# EAGLE design buseds-hab (EAGLE 6.4)
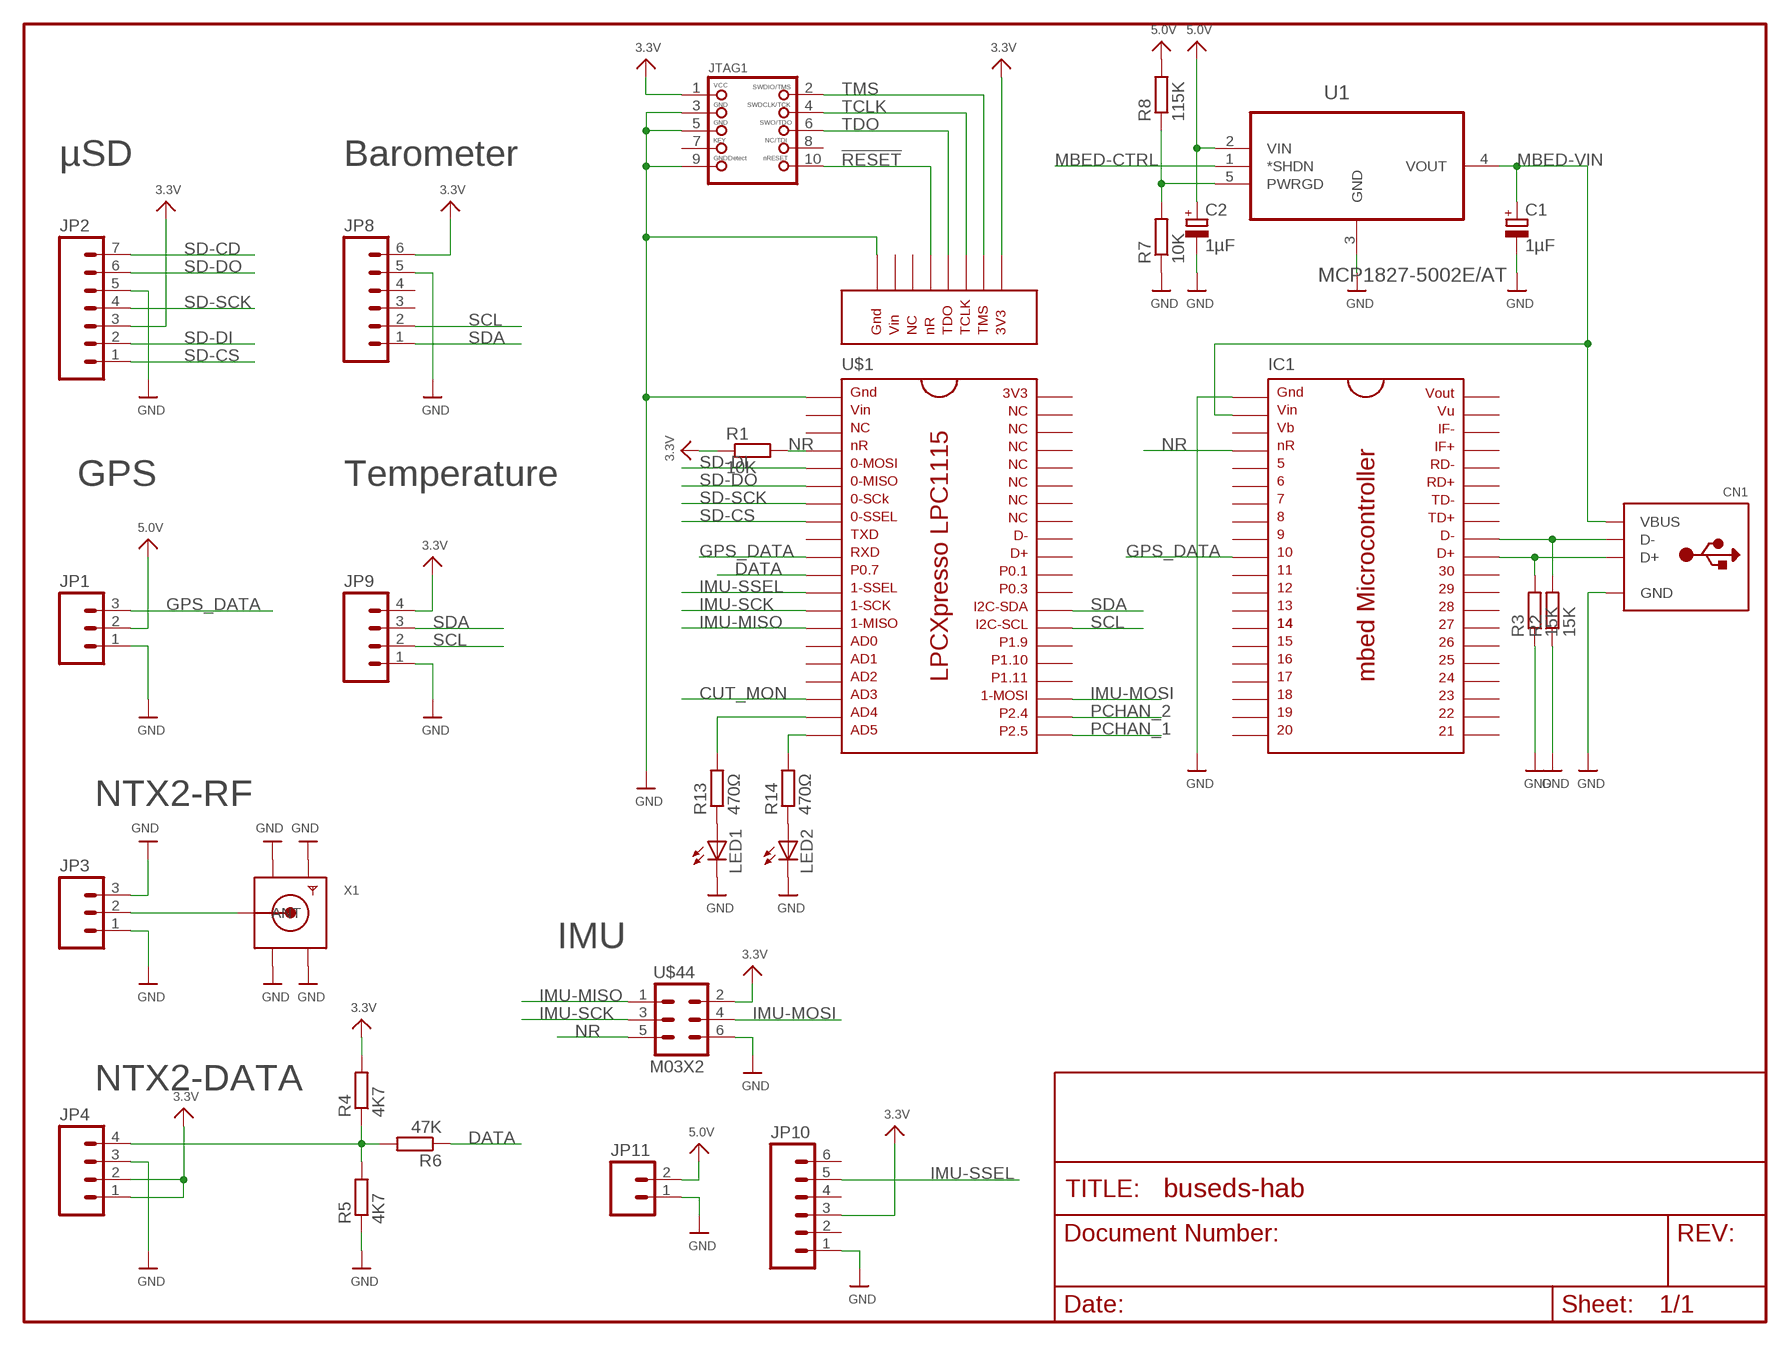
[diagram p0: schematic, sheet 1, part 1 of 2]
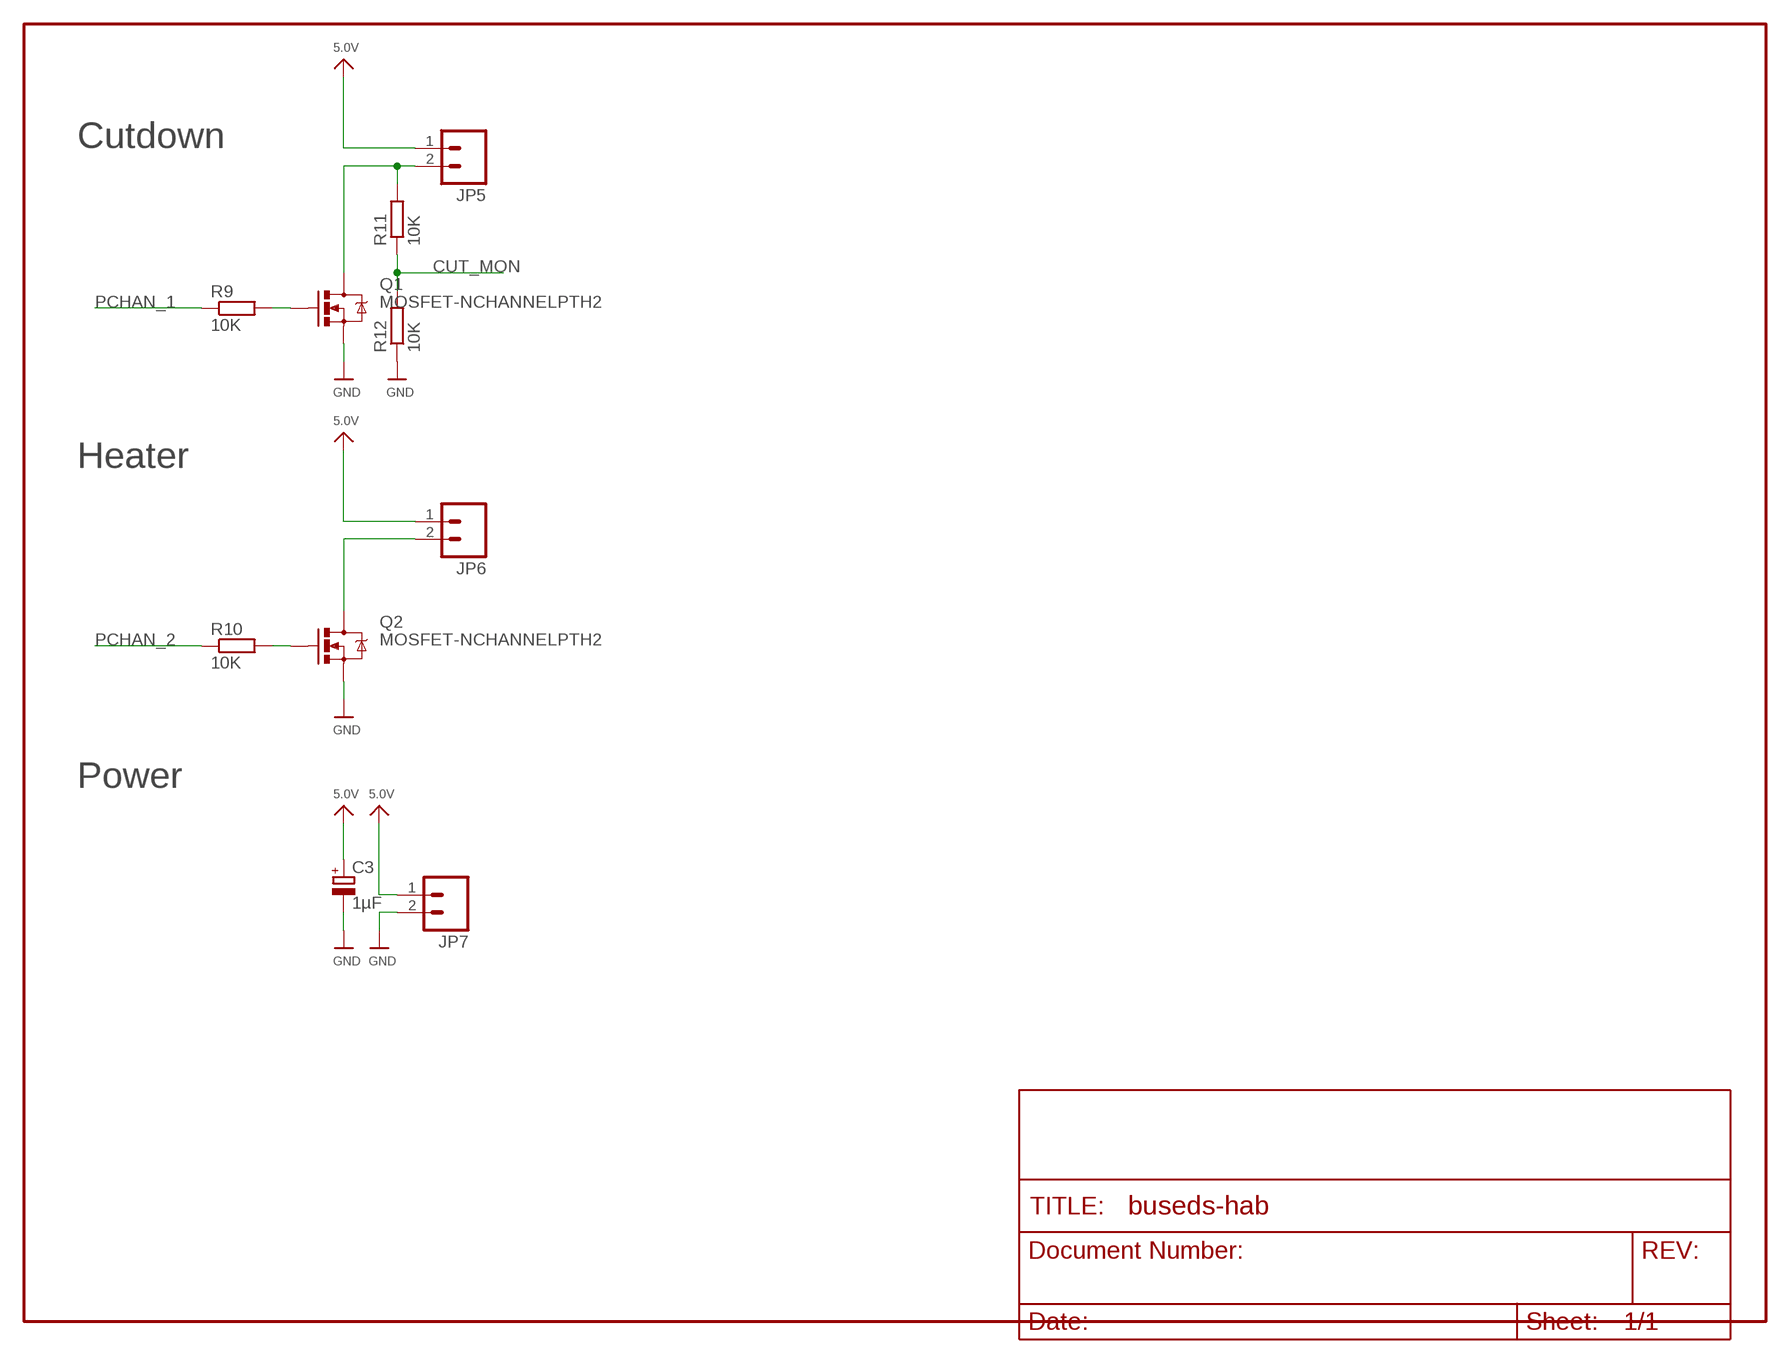
[diagram p1: schematic, sheet 1, part 2 of 2]

## Parts
C1  1µF  CPOL-EUE2-5  [E2-5]
C2  1µF  CPOL-EUE2-5  [E2-5]
C3  1µF  CPOL-EUE2-5  [E2-5]
CN1  USB_TYPEAPTHFML  [USB_HOST-PTH]
IC1  MBED  [DIL40_0.9]
JP1  M03LOCK  [1X03_LOCK]
JP2  M07LOCK  [1X07_LOCK]
JP3  M03LOCK  [1X03_LOCK]
JP4  M04LOCK  [1X04_LOCK]
JP5  M023.5MM_LOCK  [SCREWTERMINAL-3.5MM-2_LOCK]
JP6  M023.5MM_LOCK  [SCREWTERMINAL-3.5MM-2_LOCK]
JP7  M023.5MM_LOCK  [SCREWTERMINAL-3.5MM-2_LOCK]
JP8  M06LOCK  [1X06_LOCK]
JP9  M04LOCK  [1X04_LOCK]
JP10  M06LOCK  [1X06_LOCK]
JP11  M02LOCK  [1X02_LOCK]
JTAG1  JTAG-CORTEXM3  [2X05_1.27MM]
LED1  LED3MM  [LED3MM]
LED2  LED3MM  [LED3MM]
Q1  MOSFET-NCHANNELPTH2  [TO220V]
Q2  MOSFET-NCHANNELPTH2  [TO220V]
R1  10K  R-EU_0204/7  [0204/7]
R2  15K  R-EU_0204/7  [0204/7]
R3  15K  R-EU_0204/7  [0204/7]
R4  4K7  R-EU_0204/7  [0204/7]
R5  4K7  R-EU_0204/7  [0204/7]
R6  47K  R-EU_0204/7  [0204/7]
R7  10K  R-EU_0204/7  [0204/7]
R8  115K  R-EU_0204/7  [0204/7]
R9  10K  R-EU_0204/7  [0204/7]
R10  10K  R-EU_0204/7  [0204/7]
R11  10K  R-EU_0204/7  [0204/7]
R12  10K  R-EU_0204/7  [0204/7]
R13  470Ω  R-EU_0204/7  [0204/7]
R14  470Ω  R-EU_0204/7  [0204/7]
U1  MCP1827-5002E/AT  [TO170P482X1024X3124-5P]
U$1  LPCXPRESSOLPC  [LPCXPRESSO]
U$44  M03X2  [2X3_LOCK]
X1  SMACONNECTOR  [SMA90_DIP]

## Nets
3.3V: JP2.3 JP4.1 JP4.2 JP8.6 JP9.4 JP10.3 JTAG1.1 R1.1 R4.2 U$1.P-1 U$44.2
5.0V: C2.+ C3.+ JP1.2 JP5.1 JP6.1 JP7.1 JP11.2 R8.2 U1.2(VIN)
!RESET!: JTAG1.10 U$1.P-5
CUT_MON: R11.1 R12.2 U$1.18
D+: CN1.D+ IC1.31 R3.2
D-: CN1.D- IC1.32 R2.2
DATA: R6.1 U$1.11
GND: C1.- C2.- C3.- CN1.GND IC1.1 JP1.1 JP2.5 JP3.1 JP3.3 JP4.3 JP7.2 JP8.5 JP9.1 JP10.1 JP11.1 JTAG1.3 JTAG1.5 JTAG1.9 LED1.K(C) LED2.K(C) Q1.3(S) Q2.3(S) R2.1 R3.1 R5.1 R7.1 R12.1 U1.3(GND) U$1.1 U$1.P-8 U$44.6 X1.GND1 X1.GND2 X1.GND3 X1.GND4
GPS_DATA: IC1.10 JP1.3 U$1.10
IMU-MISO: U$1.14 U$44.1
IMU-MOSI: U$1.23 U$44.4
IMU-SCK: U$1.13 U$44.3
IMU-SSEL: JP10.5 U$1.12
MBED-CTRL: U1.1(*SHDN)
MBED-VIN: C1.+ CN1.VBUS IC1.2 U1.4(VOUT)
N$1: R7.2 R8.1 U1.5(PWRGD)
N$3: LED1.A R13.1
N$4: LED2.A R14.1
N$5: R14.2 U$1.20
N$6: R13.2 U$1.19
NR: IC1.4 R1.2 U$1.4 U$44.5
PCHAN_1: R9.1 U$1.21
PCHAN_1_G: Q1.1(G) R9.2
PCHAN_1_S: JP5.2 Q1.2(D) R11.2
PCHAN_2: R10.1 U$1.22
PCHAN_2_G: Q2.1(G) R10.2
PCHAN_2_S: JP6.2 Q2.2(D)
RF: JP3.2 X1.ANTENNA(ANT)
RF-DATA: JP4.4 R4.1 R5.2 R6.2
SCL: JP8.2 JP9.2 U$1.27
SD-CD: JP2.7
SD-CS: JP2.1 U$1.8
SD-DI: JP2.2 U$1.5
SD-DO: JP2.6 U$1.6
SD-SCK: JP2.4 U$1.7
SDA: JP8.1 JP9.3 U$1.28
TCLK: JTAG1.4 U$1.P-3
TDO: JTAG1.6 U$1.P-4
TMS: JTAG1.2 U$1.P-2
Unconnected: IC1.3 IC1.5 IC1.6 IC1.7 IC1.8 IC1.9 IC1.11 IC1.12 IC1.13 IC1.14 IC1.15 IC1.16 IC1.17 IC1.18 IC1.19 IC1.20 IC1.21 IC1.22 IC1.23 IC1.24 IC1.25 IC1.26 IC1.27 IC1.28 IC1.29 IC1.30 IC1.33 IC1.34 IC1.35 IC1.36 IC1.37 IC1.38 IC1.39 IC1.40 JP8.3 JP8.4 JP10.2 JP10.4 JP10.6 JTAG1.7 JTAG1.8 U$1.2 U$1.3 U$1.9 U$1.15 U$1.16 U$1.17 U$1.24 U$1.25 U$1.26 U$1.29 U$1.30 U$1.31 U$1.32 U$1.33 U$1.34 U$1.35 U$1.36 U$1.37 U$1.38 U$1.39 U$1.40 U$1.P-6 U$1.P-7

## Notes on the sheet
- Cutdown
- µSD | Barometer
- Heater
- GPS | Temperature
- Power
- NTX2-RF
- IMU
- NTX2-DATA

## Library data of the parts
C1-C3 = resistor:CPOL-EU: POLARIZED CAPACITOR, European symbol
CN1 = microbuilder_v3:USB_TYPEA: USB - Type A Connectors Male types stick out and are inserted into a PC or matching females parts (these are the connectors used on USB Memory Sticks, etc.). Female parts are generally used for USB Host and accept a male-type connector. SMT Male - 4UCON: 10017 PTH Female - Digikey: 609-1045-ND, 4UCon: 05241
IC1 = microbuilder_v3:MBED: mbed Microcontroller, DIP40, 0.9"
JP1 JP3 = SparkFun:M03: Header 3 Standard 3-pin 0.1" header. Use with straight break away headers (SKU : PRT-00116), right angle break away headers (PRT-00553), swiss pins (PRT-00743), machine pins (PRT-00117), and female headers (PRT-00115). Molex polarized connector foot print use with SKU : PRT-08232 with associated crimp pins and housings.
JP2 = SparkFun:M07: Header 7 Standard 7-pin 0.1" header. Use with straight break away headers (SKU : PRT-00116), right angle break away headers (PRT-00553), swiss pins (PRT-00743), machine pins (PRT-00117), and female headers (PRT-00115). NOTES ON THE VARIANTS LOCK and LOCK_LONGPADS... This footprint was designed to help hold the alignment of a through-hole component (i.e. 7-pin header) while soldering it into place. You may notice that each hole has been shifted either up or down by 0.005 of an inch from it's more standard position (which is usually a perfectly straight line). This slight alteration caused the pins (the squares in the middle) to touch the edges of the holes. Because they are alternating, it causes a "brace" to hold the header in place. 0.005 has proven to be the perfect amount of "off-center" position when using our standard breakaway headers. Although looks a little odd when you look at the bare footprint, once you have a header in there, the alteration is very hard to notice. Also, if you push a header all the way into place, it is covered up entirely on the bottom side. This idea of altering the position of holes to aid alignment will be further integrated into the Sparkfun Library for other footprints. It can help hold any component with 3 or more connection pins.
JP4 JP9 = SparkFun:M04: Header 4 Standard 4-pin 0.1" header. Use with straight break away headers (SKU : PRT-00116), right angle break away headers (PRT-00553), swiss pins (PRT-00743), machine pins (PRT-00117), and female headers (PRT-00115). Molex polarized connector foot print use with SKU : PRT-08231 with associated crimp pins and housings. 1MM SMD Version SKU: PRT-10208
JP5-JP7 JP11 = SparkFun:M02: Header 2 Standard 2-pin 0.1" header. Use with straight break away headers (SKU : PRT-00116), right angle break away headers (PRT-00553), swiss pins (PRT-00743), machine pins (PRT-00117), and female headers (PRT-00115). Molex polarized connector foot print use with SKU : PRT-08233 with associated crimp pins and housings.
JP8 JP10 = SparkFun:M06: Header 6 Standard 6-pin 0.1" header. Use with straight break away headers (SKU : PRT-00116), right angle break away headers (PRT-00553), swiss pins (PRT-00743), machine pins (PRT-00117), and female headers (PRT-00115). Molex polarized connector foot print use with SKU : PRT-08094 with associated crimp pins and housings. NOTES ON THE VARIANTS LOCK and LOCK_LONGPADS... This footprint was designed to help hold the alignment of a through-hole component (i.e. 6-pin header) while soldering it into place. You may notice that each hole has been shifted either up or down by 0.005 of an inch from it's more standard position (which is a perfectly straight line). This slight alteration caused the pins (the squares in the middle) to touch the edges of the holes. Because they are alternating, it causes a "brace" to hold the component in place. 0.005 has proven to be the perfect amount of "off-center" position when using our standard breakaway headers. Although looks a little odd when you look at the bare footprint, once you have a header in there, the alteration is very hard to notice. Also, if you push a header all the way into place, it is covered up entirely on the bottom side. This idea of altering the position of holes to aid alignment will be further integrated into the Sparkfun Library for other footprints. It can help hold any component with 3 or more connection pins.
JTAG1 = microbuilder_v3:JTAG-CORTEXM3: Serial Wire (SW-DP) Connector This standard 0.05" 10-pin connector is for use with the Cortex M0/M3's native SWD (serial wire debugger) interface (SW-DP). Some boards support a 20-pin combined JTAG+SWD connector (SWJ-DP), such as the LPC1700 family, but many smaller devices only work with SWD which typically use the smaller 10-pin SW-DP connecter (the LPC1300 family, for example, only supports SWD). 2x05 1.27mm/0.05" Connector: This is the standard SMT connector defined by ARM for all Cortex devices, and should be used in most situations and for forward-compatibility since any new devices coming to market will likely use this connector. MOLEX 10 Pin 0.1" Connector: This 0.1" 10 pin connector has the same pin layout as the standard 0.05" connector, but is easier to work with if you are using standard jumper wires or custom cables to connect your SWD hardware. MOLEX 20 Pin 0.1" Connector: This 0.1" 20 pin connector is the same model used for ARM7/ARM9 JTAG debuggers, but is connected to match the pins on the Segger J-Link for ARM (which supports both JTAG and SWD debugging). See the following document from ARM for more information on Cortex M3 Debug Connectors: http://infocenter.arm.com/help/topic/com.arm.doc.faqs/attached/13634/cortex_debug_connectors.pdf And the following page for an overview with images of the different connector types: http://www.keil.com/peripherals/coresight/connectors.asp
LED1 LED2 = SparkFun:LED: LEDs Standard schematic elements and footprints for 5mm, 3mm, 1206, and 0603 sized LEDs. 5mm - Spark Fun Electronics SKU : COM-00529 (and others)
Q1 Q2 = SparkFun:MOSFET-NCHANNEL
R1-R14 = resistor:R-EU_: RESISTOR, European symbol
U1 = MCP1827:MCP1827-5002E/AT: IC LDO REG 1.5A 5.0V TO220-5; MPN: MCP1827-5002E/AT; OC_FARNELL: 1840847; OC_NEWARK: 88K5598; PACKAGE: TO-220-5; SUPPLIER: Microchip
U$1 = microbuilder_v3:LPCXPRESSO
U$44 = SparkFun:M03X2
X1 = microbuilder_v3:SMACONNECTOR: SMA Connector 90° DIP SMA Connector, 50 Ohm (4UConnector: 07259)

## Board
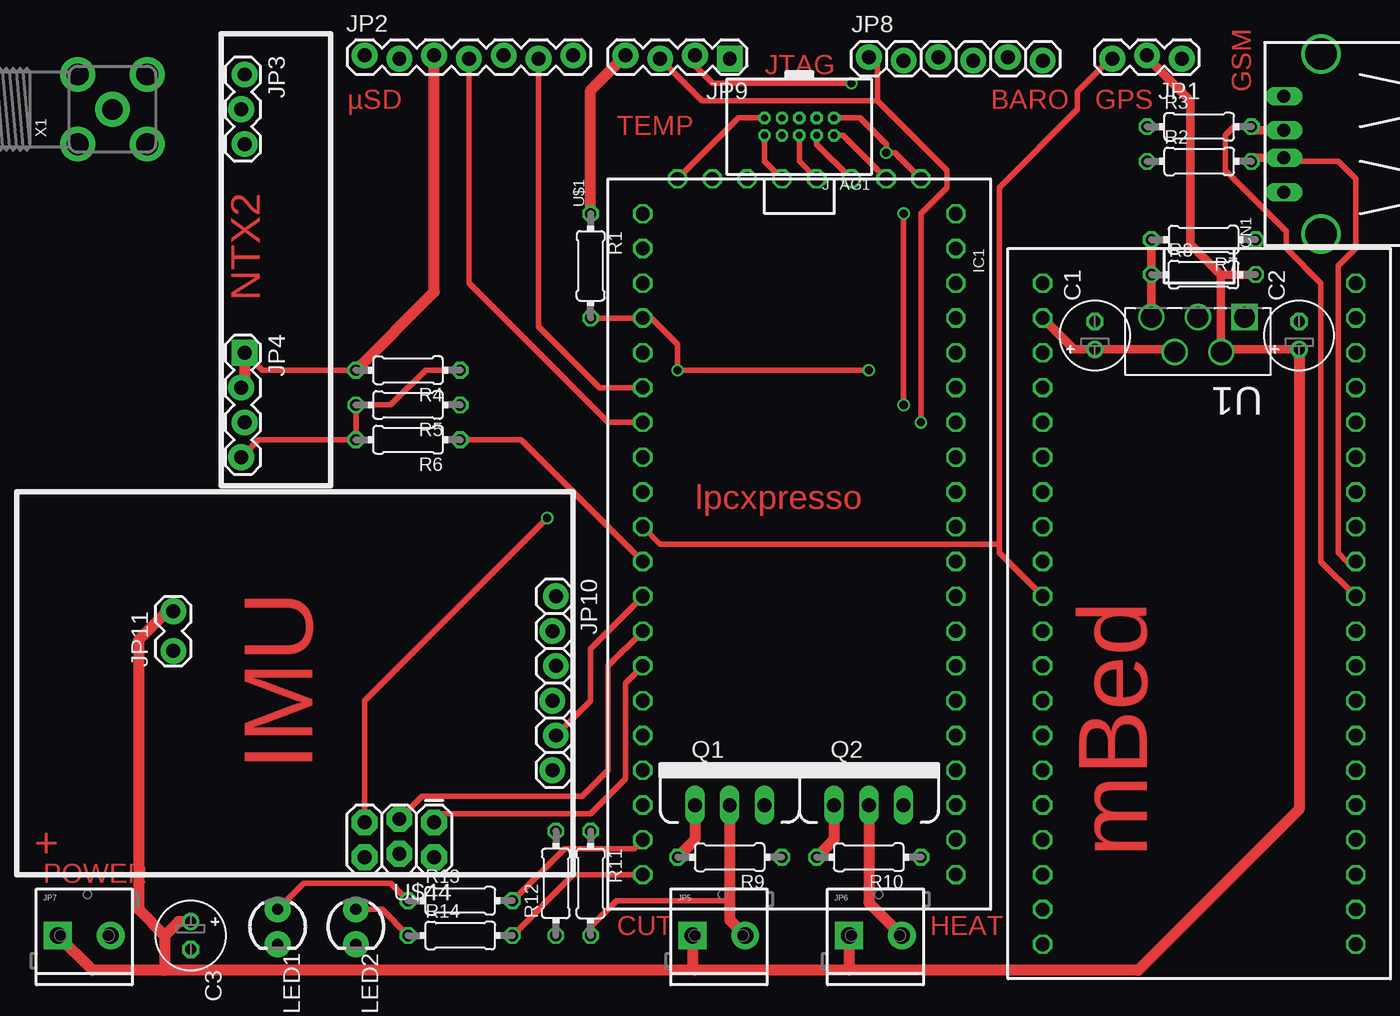
[diagram p2: board, top side]
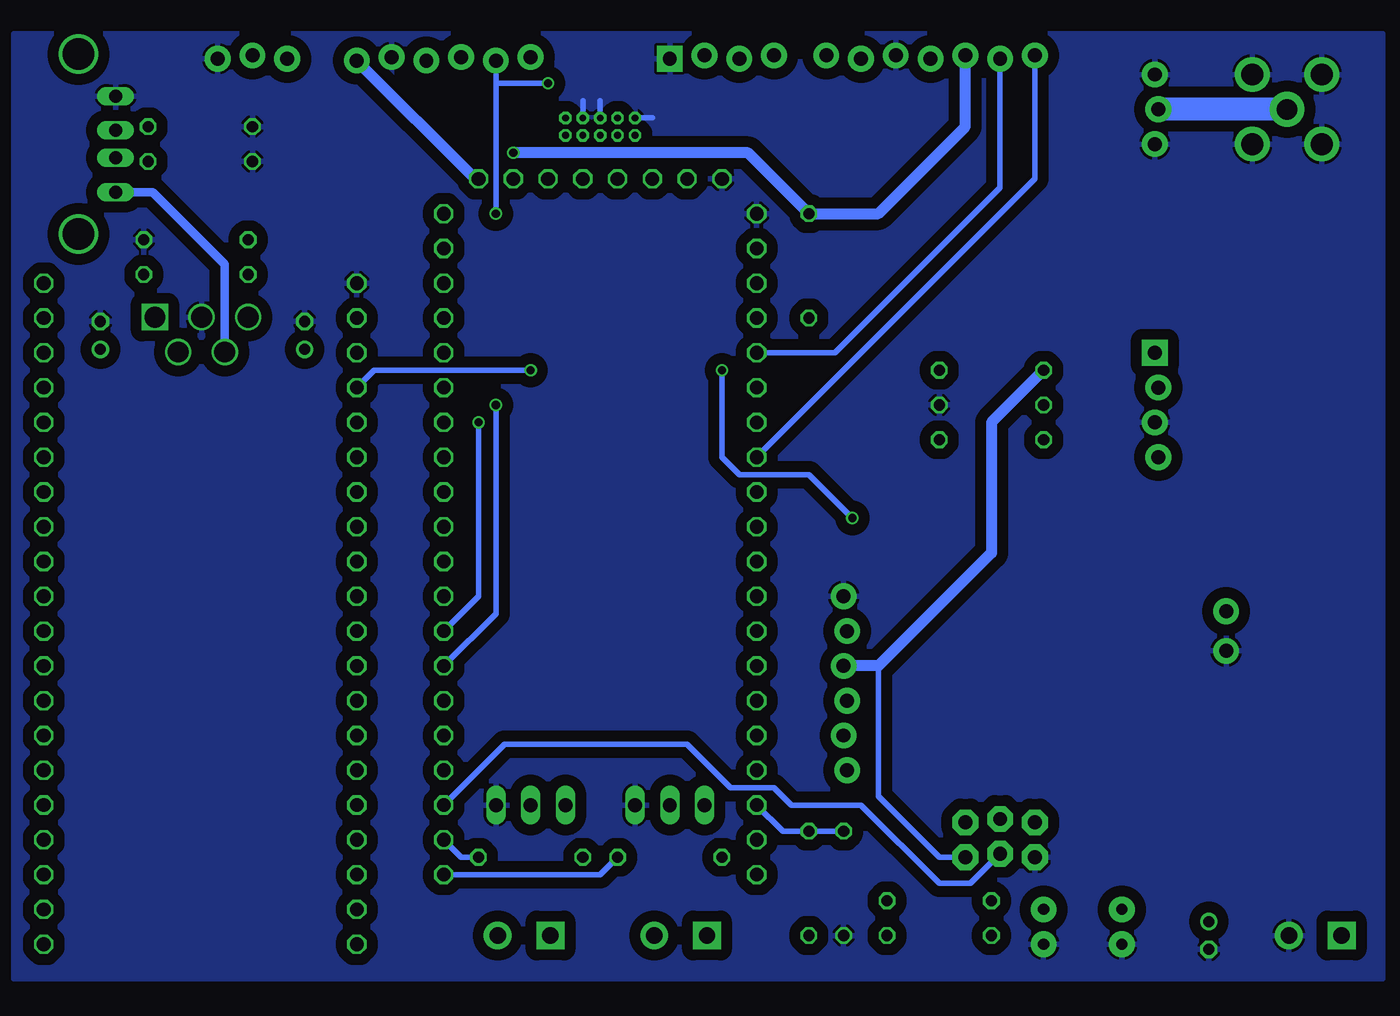
[diagram p3: board, bottom side, seen from below]

No outline drawn. Coordinates in mm, seen from the top.
Copper layers (1*16): Top 0.035mm / dielectric 1.5mm / Bottom 0.035mm
Design rules "PCB-POOL Standard": minimum track width 0.15mm, minimum drill 0.3mm, track to track 0.15mm, track to pad 0.15mm, pad to pad 0.15mm, via to via 0.15mm, smd to smd 0.15mm, copper to edge 0.3mm, drill to drill 0.2mm, minimum pad ring 0.2mm, minimum via ring 0.15mm, stop-mask expansion 0.075mm, vias tented up to drill 0mil, thermal gap 0.2mm

### Footprints (pad centres in the part's own frame; a part is rotated, then mirrored left to right if it is on the bottom)
E2-5 = drill 0.813 pad 1.27: + -1.016,0 | drill 0.813 pad 1.27 octagon: - 1.016,0
USB_HOST-PTH = drill 0.95 long: D+ 1,6.52; D- -1,6.52; GND 3.5,6.52; VBUS -3.5,6.52 | drill 2.3 pad 2.9: S1 -6.57,3.81; S2 6.57,3.81
DIL40_0.9 = drill 1 pad 1.397 octagon: 1 -22.86,-11.43; 2 -20.32,-11.43; 3 -17.78,-11.43; 4 -15.24,-11.43; 5 -12.7,-11.43; 6 -10.16,-11.43; 7 -7.62,-11.43; 8 -5.08,-11.43; 9 -2.54,-11.43; 10 0,-11.43; 11 2.54,-11.43; 12 5.08,-11.43; 13 7.62,-11.43; 14 10.16,-11.43; 15 12.7,-11.43; 16 15.24,-11.43; 17 17.78,-11.43; 18 20.32,-11.43; 19 22.86,-11.43; 20 25.4,-11.43; 21 25.4,11.43; 22 22.86,11.43; 23 20.32,11.43; 24 17.78,11.43; 25 15.24,11.43; 26 12.7,11.43; 27 10.16,11.43; 28 7.62,11.43; 29 5.08,11.43; 30 2.54,11.43; 31 0,11.43; 32 -2.54,11.43; 33 -5.08,11.43; 34 -7.62,11.43; 35 -10.16,11.43; 36 -12.7,11.43; 37 -15.24,11.43; 38 -17.78,11.43; 39 -20.32,11.43; 40 -22.86,11.43
1X03_LOCK = drill 1.016 pad 1.88: 1 0,0.127; 2 2.54,-0.127; 3 5.08,0.127
1X07_LOCK = drill 1.016 pad 1.88: 1 0,0.127; 2 2.54,-0.127; 3 5.08,0.127; 4 7.62,-0.127; 5 10.16,0.127; 6 12.7,-0.127; 7 15.24,0.127
1X04_LOCK = drill 1.016 pad 1.88 square: 1 0,0.127 | drill 1.016 pad 1.88: 2 2.54,-0.127; 3 5.08,0.127; 4 7.62,-0.127
SCREWTERMINAL-3.5MM-2_LOCK = drill 1.2 pad 2.032 square: 1 -0.178,0 | drill 1.2 pad 2.032: 2 3.678,0
1X06_LOCK = drill 1.016 pad 1.88: 1 0,0; 2 2.54,-0.254; 3 5.08,0; 4 7.62,-0.254; 5 10.16,0; 6 12.7,-0.254
1X02_LOCK = drill 1.016 pad 1.88: 1 -0.178,0; 2 2.718,0
2X05_1.27MM = drill 0.5 octagon: 1 -2.54,-0.635; 2 -2.54,0.635; 3 -1.27,-0.635; 4 -1.27,0.635; 5 0,-0.635; 6 0,0.635; 7 1.27,-0.635; 8 1.27,0.635; 9 2.54,-0.635; 10 2.54,0.635
LED3MM = drill 0.813 pad 1.88: A -1.27,0; K 1.27,0
TO220V = drill 1.016 long: 1 -2.54,0; 2 0,0; 3 2.54,0
0204/7 = drill 0.813 octagon: 1 -3.81,0; 2 3.81,0
TO170P482X1024X3124-5P = drill 1.524 square: 1 -6.807,-3.556 | drill 1.524: 2 -5.105,-1.016; 3 -3.404,-3.556; 4 -1.702,-1.016; 5 0,-3.556
LPCXPRESSO = drill 1 pad 1.397 octagon: 1 -21.59,-11.43; 2 -19.05,-11.43; 3 -16.51,-11.43; 4 -13.97,-11.43; 5 -11.43,-11.43; 6 -8.89,-11.43; 7 -6.35,-11.43; 8 -3.81,-11.43; 9 -1.27,-11.43; 10 1.27,-11.43; 11 3.81,-11.43; 12 6.35,-11.43; 13 8.89,-11.43; 14 11.43,-11.43; 15 13.97,-11.43; 16 16.51,-11.43; 17 19.05,-11.43; 18 21.59,-11.43; 19 24.13,-11.43; 20 26.67,-11.43; 21 26.67,11.43; 22 24.13,11.43; 23 21.59,11.43; 24 19.05,11.43; 25 16.51,11.43; 26 13.97,11.43; 27 11.43,11.43; 28 8.89,11.43; 29 6.35,11.43; 30 3.81,11.43; 31 1.27,11.43; 32 -1.27,11.43; 33 -3.81,11.43; 34 -6.35,11.43; 35 -8.89,11.43; 36 -11.43,11.43; 37 -13.97,11.43; 38 -16.51,11.43; 39 -19.05,11.43; 40 -21.59,11.43; P-1 -24.13,8.89; P-2 -24.13,6.35; P-3 -24.13,3.81; P-4 -24.13,1.27; P-5 -24.13,-1.27; P-6 -24.13,-3.81; P-7 -24.13,-6.35; P-8 -24.13,-8.89
2X3_LOCK = drill 1.016 pad 1.88 octagon: 1 0,0; 2 0,2.54; 3 2.54,-0.254; 4 2.54,2.286; 5 5.08,0; 6 5.08,2.54
SMA90_DIP = drill 1.5 pad 2.54: ANTENNA 0,0 | drill 1.6 pad 2.54: GND1 -2.54,2.54; GND2 2.54,2.54; GND3 -2.54,-2.54; GND4 2.54,-2.54

### Placement (x,y rotation side)
C1  78.74,46.99 90 top
C2  93.66,46.99 90 top
C3  12.7,3.17 270 top
CN1  99.06,60.96 90 top
IC1  86.36,27.94 270 top
JP1  85.09,67.31 180 top
JP2  25.4,67.31 0 top
JP3  16.51,66.04 270 top
JP4  16.51,45.72 270 top
JP5  49.53,3.17 0 top
JP6  60.96,3.17 0 top
JP7  3.17,3.17 0 top
JP8  62.23,67.31 0 top
JP9  52.07,67.31 180 top
JP10  39.37,27.94 270 top
JP11  11.43,24.13 90 top
JTAG1  57.15,62.23 180 top
LED1  19.05,3.81 270 top
LED2  24.77,3.81 270 top
Q1  52.07,12.7 0 top
Q2  62.23,12.7 0 top
R1  41.91,52.07 270 top
R2  86.36,59.69 0 top
R3  86.36,62.23 0 top
R4  28.57,44.45 180 top
R5  28.57,41.91 180 top
R6  28.57,39.37 180 top
R7  86.68,53.98 180 top
R8  86.68,51.44 0 top
R9  52.07,8.89 180 top
R10  62.23,8.89 180 top
R11  41.91,6.99 270 top
R12  39.37,6.99 90 top
R13  32.38,5.71 0 top
R14  32.38,3.17 0 top
U1  82.87,44.77 180 top
U$1  57.15,34.29 270 top
U$44  30.48,11.43 180 top
X1  6.99,63.5 90 top

### Tracks (layer width: path | path; a pad name or v marks a point on that pad's centre or on a via)
3.3V  (via drill 0.6)
  Top 0.406: JTAG1.1 61.59,62.87 63.5,60.96 v63.5,60.33 64.14,60.33 U$1.P-1 | JP4.1 17.91,44.45 R4.2 | 44.45,67.31 JP9.4
  Top 0.813: JP4.1 16.64,43.43 JP4.2 | R4.2 30.48,50.16 JP2.3 | R1.1 41.91,64.9 JP9.4
  Bottom 0.406: U$44.2 32.38,8.89 36.83,13.34 36.83,22.86
  Bottom 0.813: JP2.3 30.48,62.23 36.83,55.88 R1.1 46.35,60.33 v63.5,60.33 | JP8.6 66.29,58.42 U$1.P-1 | R4.2 28.57,40.64 28.57,31.11 36.83,22.86 JP10.3
5.0V
  Top 0.61: C2.+ 88.16,45.97 U1.2 87.95,45.81 87.95,51.44 | R8.2 87.95,51.44 | 87.95,51.44 85.72,53.66 85.72,64.14 82.55,67.31 JP1.2
  Top 0.813: JP6.1 60.78,0.64 | 60.78,0.64 49.53,0.64 | 49.53,0.64 10.79,0.64 | 10.79,0.64 5.54,0.64 JP7.1 | JP5.1 49.35,0.81 49.53,0.64 | C3.+ 11.81,4.19 10.79,3.17 | 10.79,3.17 10.79,0.64 | 60.78,0.64 81.92,0.64 93.66,12.38 C2.+ | 10.79,3.17 8.89,5.08 8.89,24.77 10.97,26.85 JP11.2
!RESET!
  Top 0.406: JTAG1.10 54.61,59.69 U$1.P-5
CUT_MON
  Bottom 0.406: U$1.18 43.81,10.79 R11.1 R12.2
D+
  Top 0.406: IC1.31 95.25,30.48 95.25,50.8 92.71,53.34 92.71,54.61 88.27,59.05 88.27,61.59 88.9,62.23 R3.2
  Top 0.61: R3.2 90.44,61.96 CN1.D+
D-
  Top 0.406: IC1.32 97.16,30.48 96.52,31.11 96.52,52.07 97.79,53.34 97.79,58.42 96.52,59.69 92.81,59.69 CN1.D-
  Top 0.61: CN1.D- 90.44,59.96 R2.2
DATA
  Top 0.406: R6.1 36.83,39.37 U$1.11
GND
  Top 0.406: JTAG1.9 52.7,62.87 U$1.P-8
  Bottom 0.406: JTAG1.9 53.34,62.87 | JTAG1.3 58.42,64.14 | JTAG1.5 57.15,64.14
  pour Bottom (isolate 0.8): 0,0 100,0 100,69 0,69
GPS_DATA
  Top 0.406: JP1.3 79.88,67.18 77.47,64.77 77.47,63.5 71.75,57.78 71.75,31.75 | 71.75,31.75 71.75,31.11 IC1.10 | U$1.10 46.99,31.75 71.75,31.75
IMU-MISO
  Top 0.406: U$44.1 31.11,12.06 41.91,12.06 44.45,14.61 44.45,21.59 U$1.14
IMU-MOSI
  Bottom 0.406: U$1.23 64.14,17.14 50.8,17.14 47.62,13.97 44.45,13.97 43.18,12.7 38.1,12.7 32.38,6.99 30.1,6.99 U$44.4
IMU-SCK
  Top 0.406: U$1.13 43.18,22.86 43.18,15.24 41.27,13.34 29.59,13.34 U$44.3
IMU-SSEL
  Top 0.406: U$1.12 41.91,24.13 41.91,20.32 JP10.5
MBED-VIN
  Top 0.61: IC1.2 77.22,45.97 C1.+ 84.38,45.97 U1.4
  Bottom 0.61: CN1.VBUS 89.84,57.46 84.57,52.18 U1.4
N$1
  Top 0.61: R7.2 82.87,52.07 R8.1 U1.5
N$3
  Top 0.406: R13.1 27.3,6.99 20.95,6.99 LED1.A
N$4
  Top 0.406: R14.1 26.67,5.08 LED2.A
N$5
  Top 0.406: U$1.20 40.64,7.62 R14.2
N$6
  Top 0.406: U$1.19 45.09,9.53 40.01,9.53 R13.2
NR  (via drill 0.6)
  Top 0.406: R1.2 U$1.4 46.35,48.26 48.26,46.35 v48.26,44.45 v62.23,44.45 | U$44.5 25.4,20.32 v38.73,33.66
  Bottom 0.406: IC1.4 73.66,44.45 v62.23,44.45 | v38.73,33.66 41.91,36.83 46.99,36.83 48.26,38.1 v48.26,44.45
PCHAN_1
  Bottom 0.406: U$1.21 57.15,7.62 R9.1
PCHAN_1_G
  Top 0.813: Q1.1 49.53,10.16 R9.2
PCHAN_1_S
  Top 0.406: R11.2 41.91,3.81 43.81,5.71 52.07,5.71
  Top 0.813: Q1.2 52.07,5.71 52.07,4.31 JP5.2
PCHAN_2
  Bottom 0.406: U$1.22 67.31,8.89 R10.1
PCHAN_2_G
  Top 0.813: Q2.1 59.69,10.16 R10.2
PCHAN_2_S
  Top 0.813: Q2.2 62.23,5.58 JP6.2
RF
  Bottom 1.676: X1.ANTENNA JP3.2
RF-DATA
  Top 0.406: JP4.4 17.65,39.37 R6.2 R5.2 27.3,41.91 29.84,44.45 R4.1
SCL  (via drill 0.6)
  Top 0.406: v64.77,41.91 v64.77,55.88 | JP9.2 49.53,66.67 50.8,65.41 v60.96,65.41
  Bottom 0.406: U$1.27 64.77,26.67 v64.77,41.91 | v64.77,55.88 64.77,65.41 | 64.77,65.41 JP8.2 | v60.96,65.41 64.77,65.41
SD-CS
  Bottom 0.406: JP2.1 25.4,58.42 U$1.8
SD-DI
  Bottom 0.406: JP2.2 27.94,57.78 40.01,45.72 U$1.5
SD-DO
  Top 0.406: JP2.6 38.1,47.62 42.55,43.18 U$1.6
SD-SCK
  Top 0.406: JP2.4 33.02,50.8 43.18,40.64 U$1.7
SDA  (via drill 0.6)
  Top 0.406: v66.04,40.64 66.04,55.88 67.94,57.78 67.94,59.05 62.87,64.14 | 62.87,64.14 62.87,66.67 JP8.1 | JP9.3 50.04,64.14 62.87,64.14
  Bottom 0.406: U$1.28 66.04,27.94 v66.04,40.64
TCLK
  Top 0.406: JTAG1.4 58.42,60.96 U$1.P-3
TDO
  Top 0.406: JTAG1.6 57.15,59.69 U$1.P-4
TMS
  Top 0.406: JTAG1.2 60.33,61.59 U$1.P-2

### Text on the board
Top: JTAG | GSM | µSD | BARO | GPS | TEMP | NTX2 | lpcxpresso | IMU | + | mBed | POWER | CUT | HEAT
logos: BUSEDS | 2014